# Altium schematic sheet 0164_V1P05_CPU GENERATI.SchDoc
size 848 x 558 mm
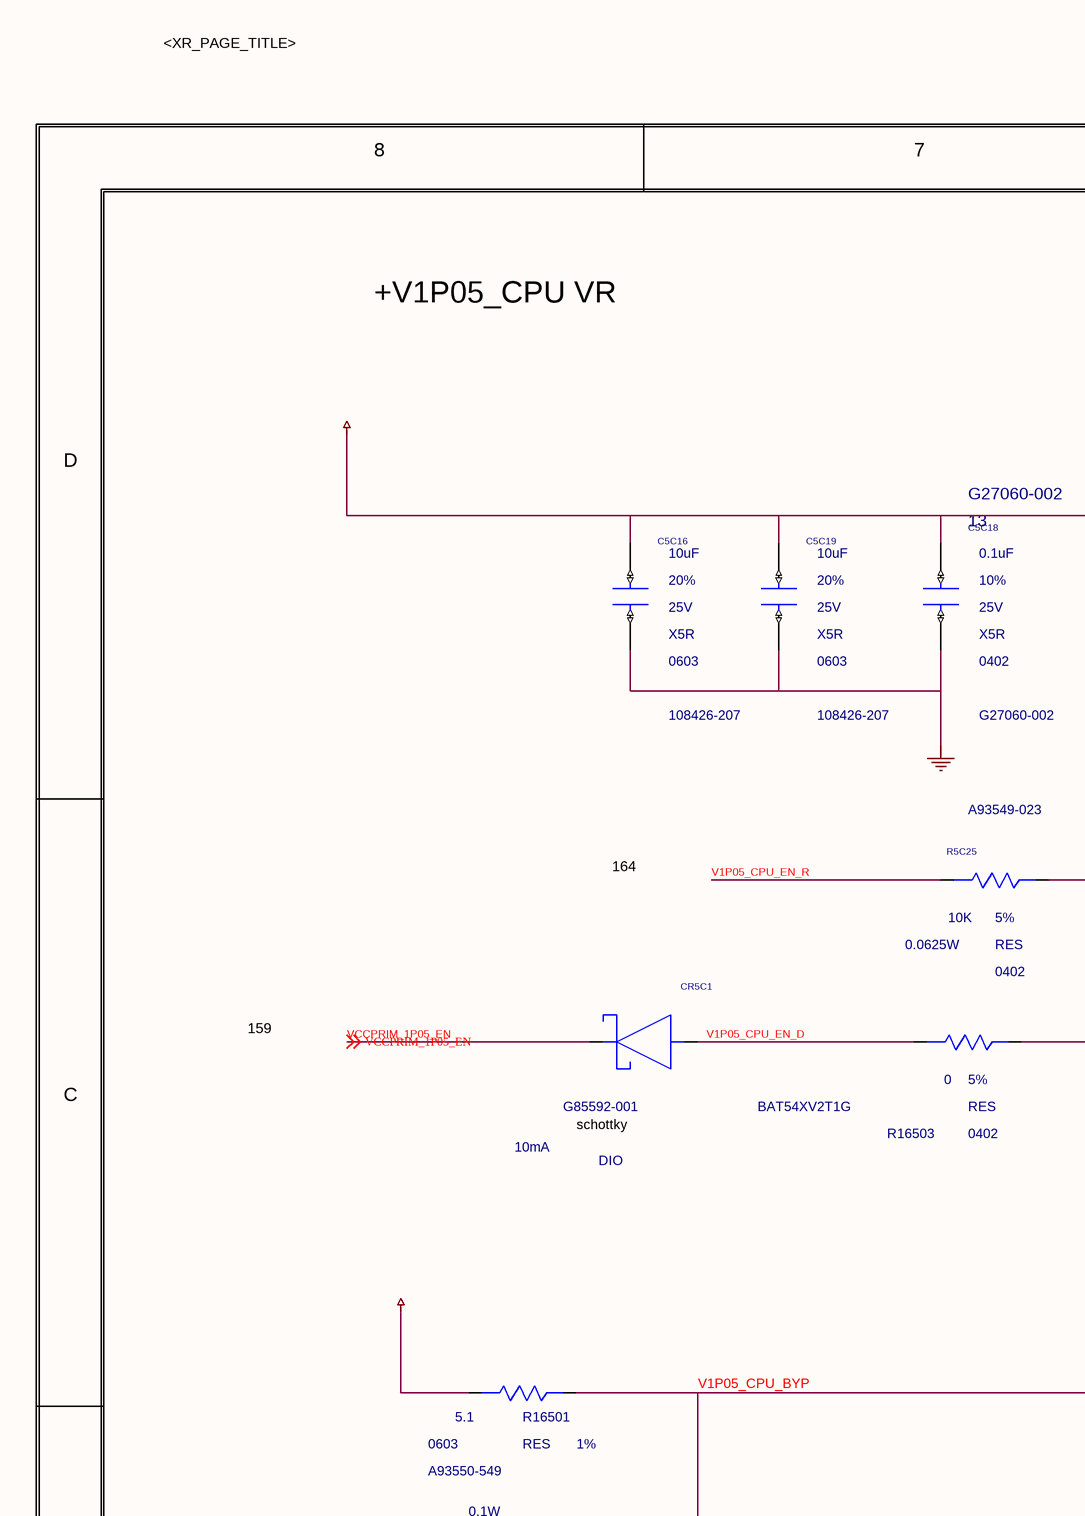
[diagram p0: 0164_V1P05_CPU GENERATI.SchDoc, top left]
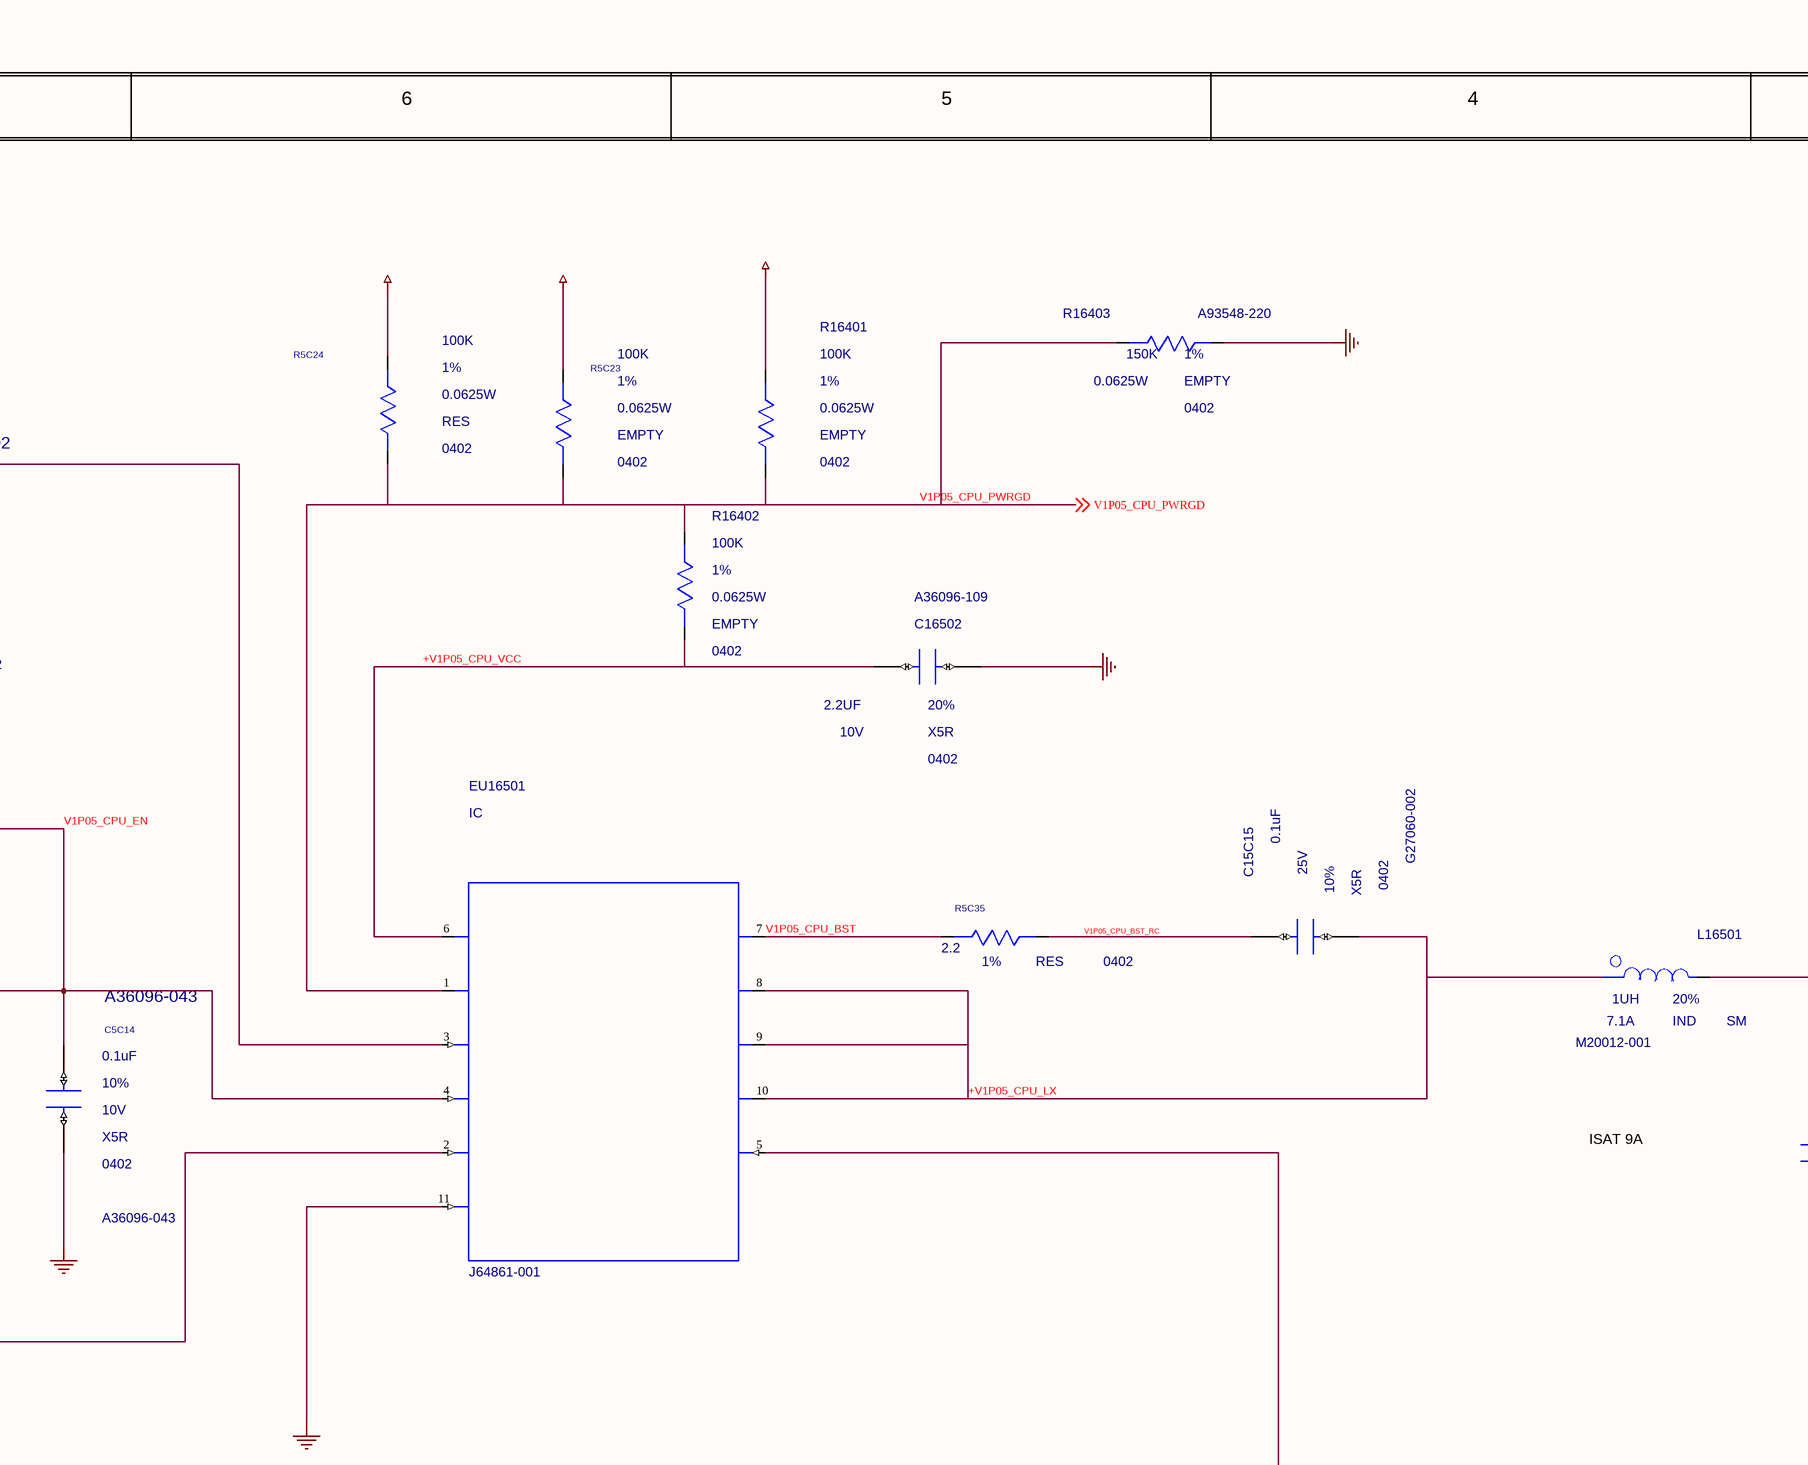
[diagram p1: 0164_V1P05_CPU GENERATI.SchDoc, top middle]
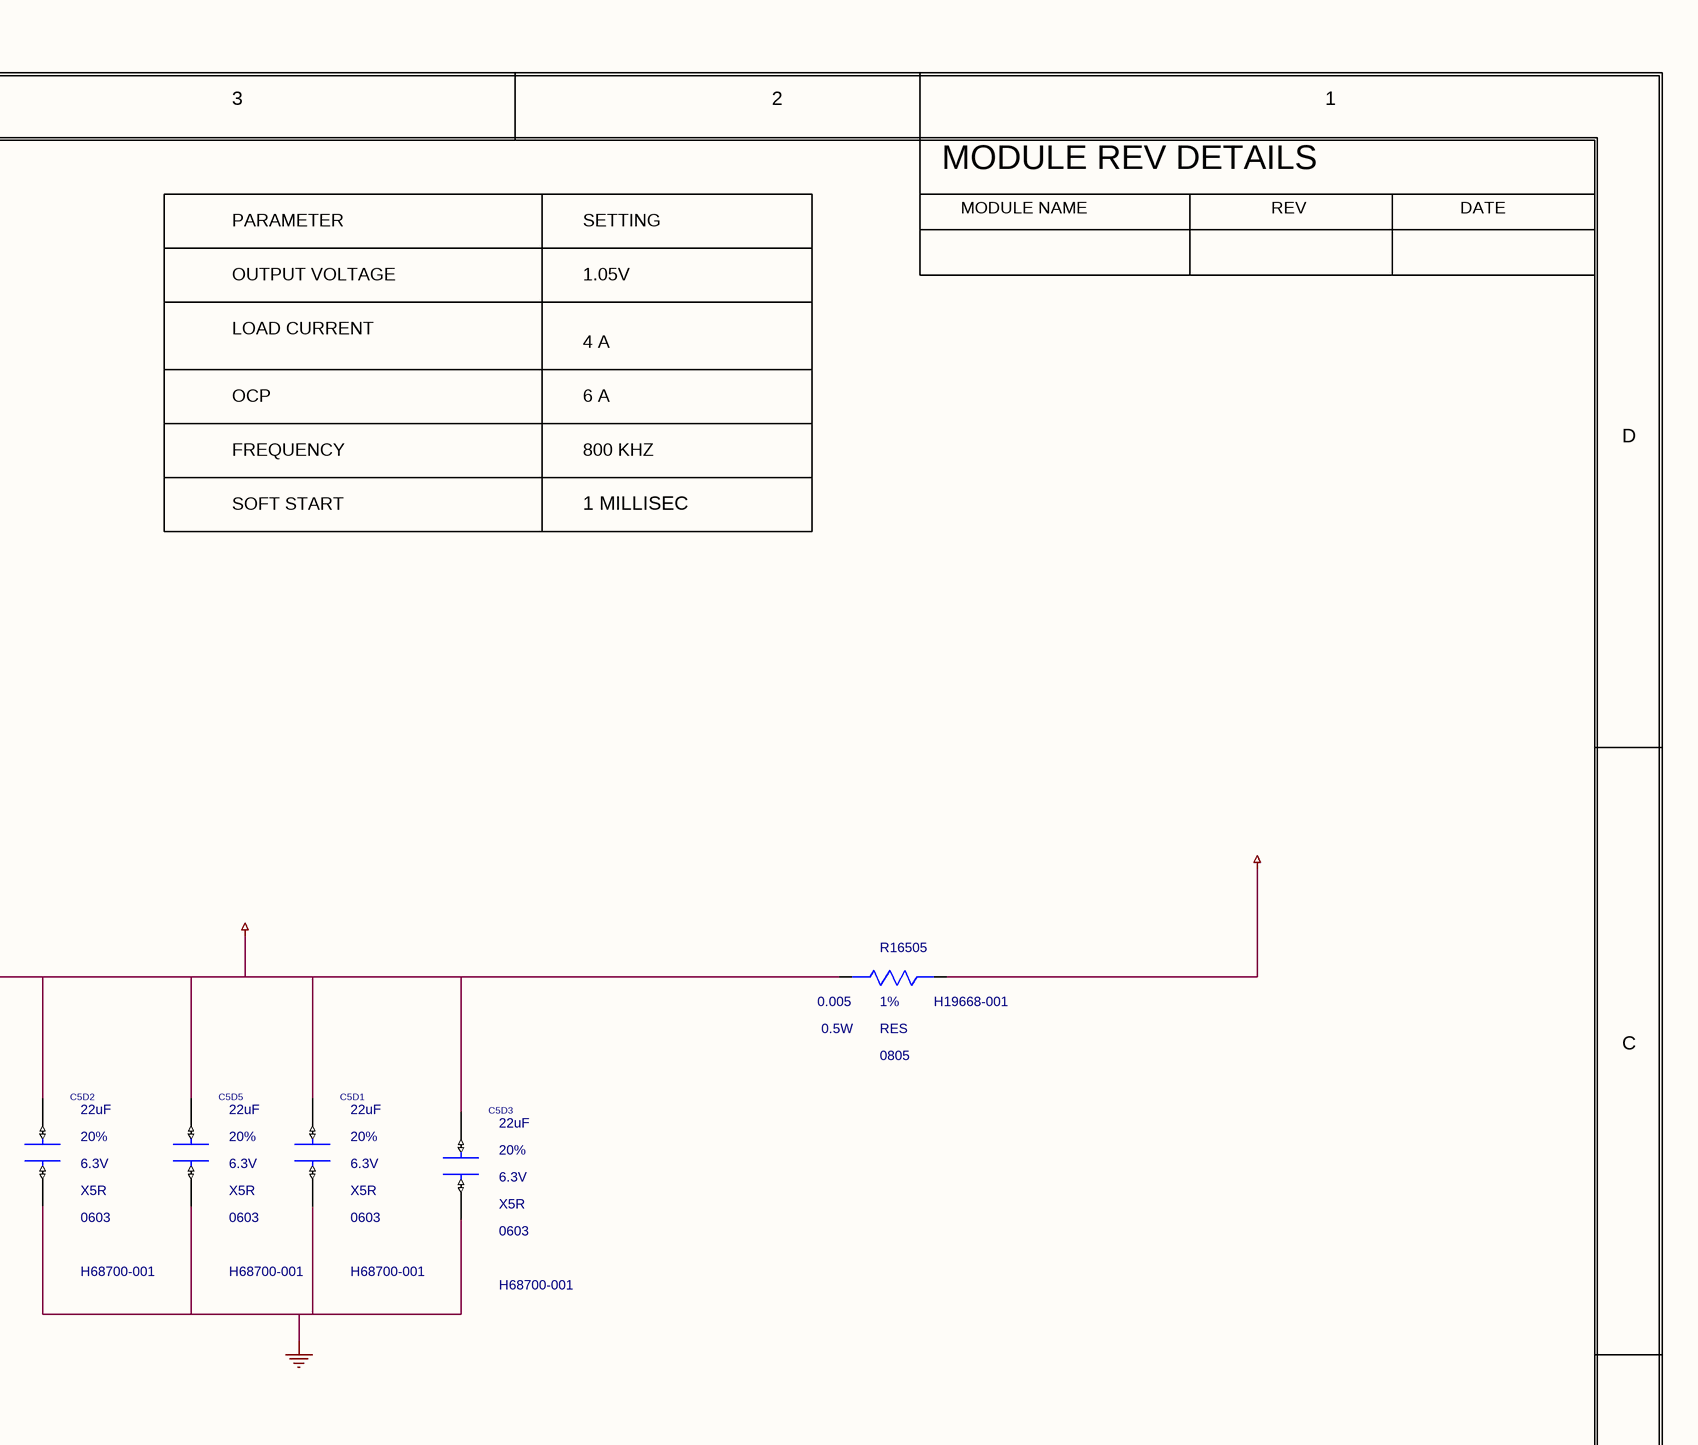
[diagram p2: 0164_V1P05_CPU GENERATI.SchDoc, top right]
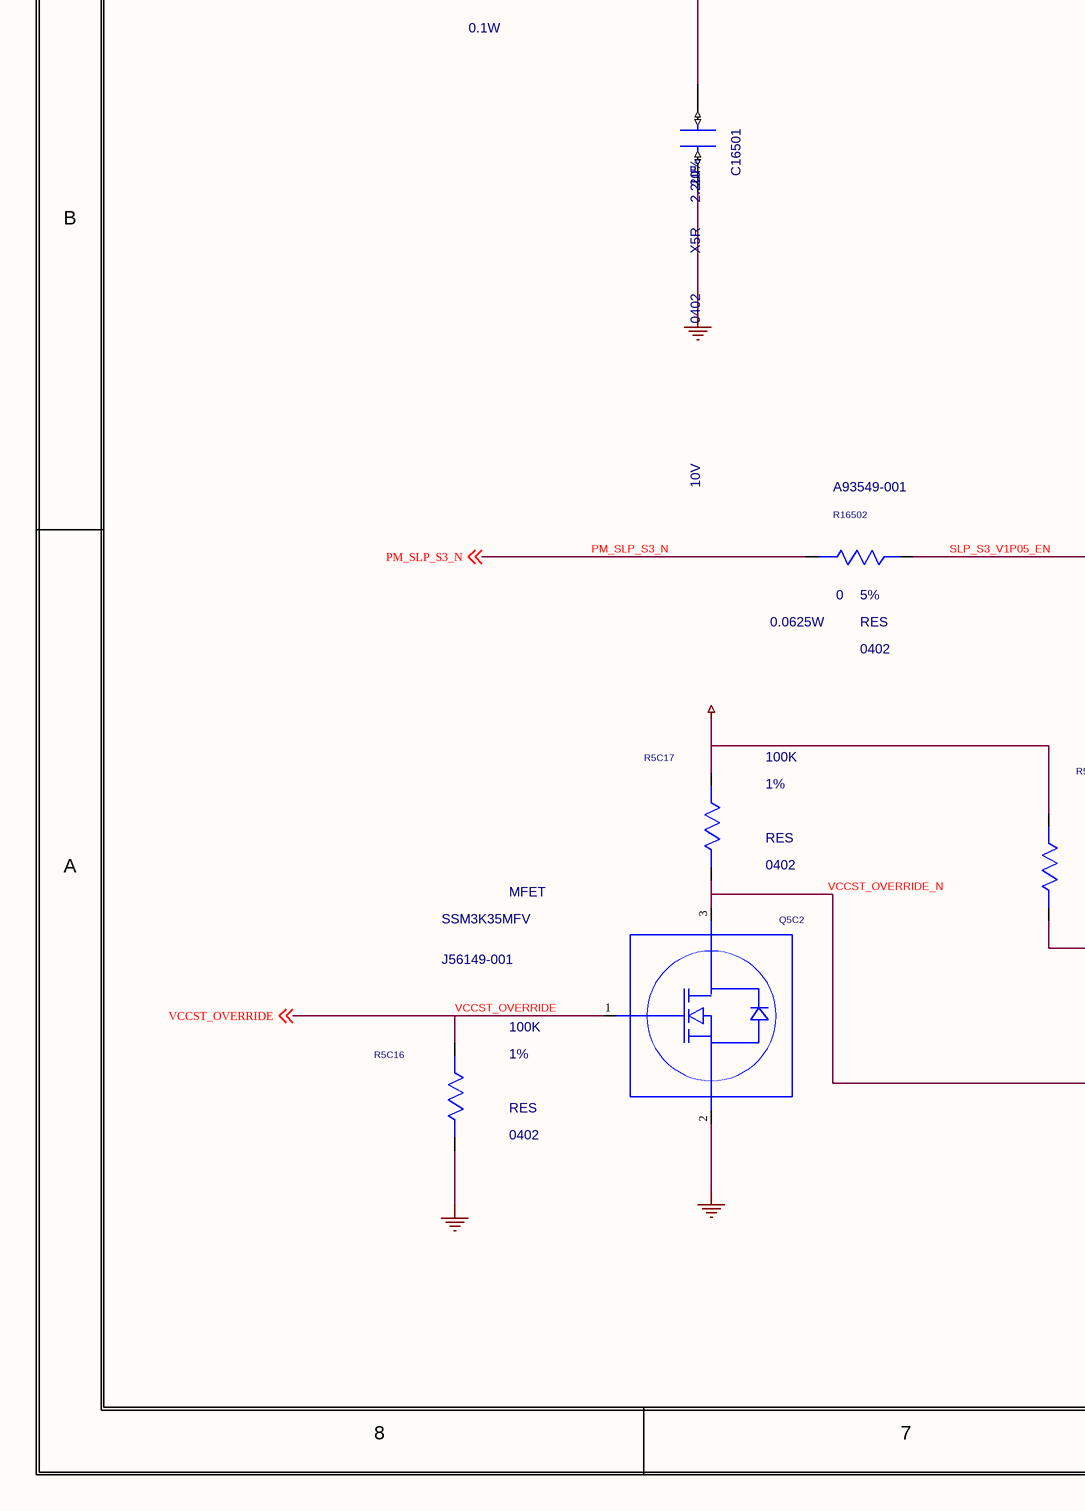
[diagram p3: 0164_V1P05_CPU GENERATI.SchDoc, bottom left]
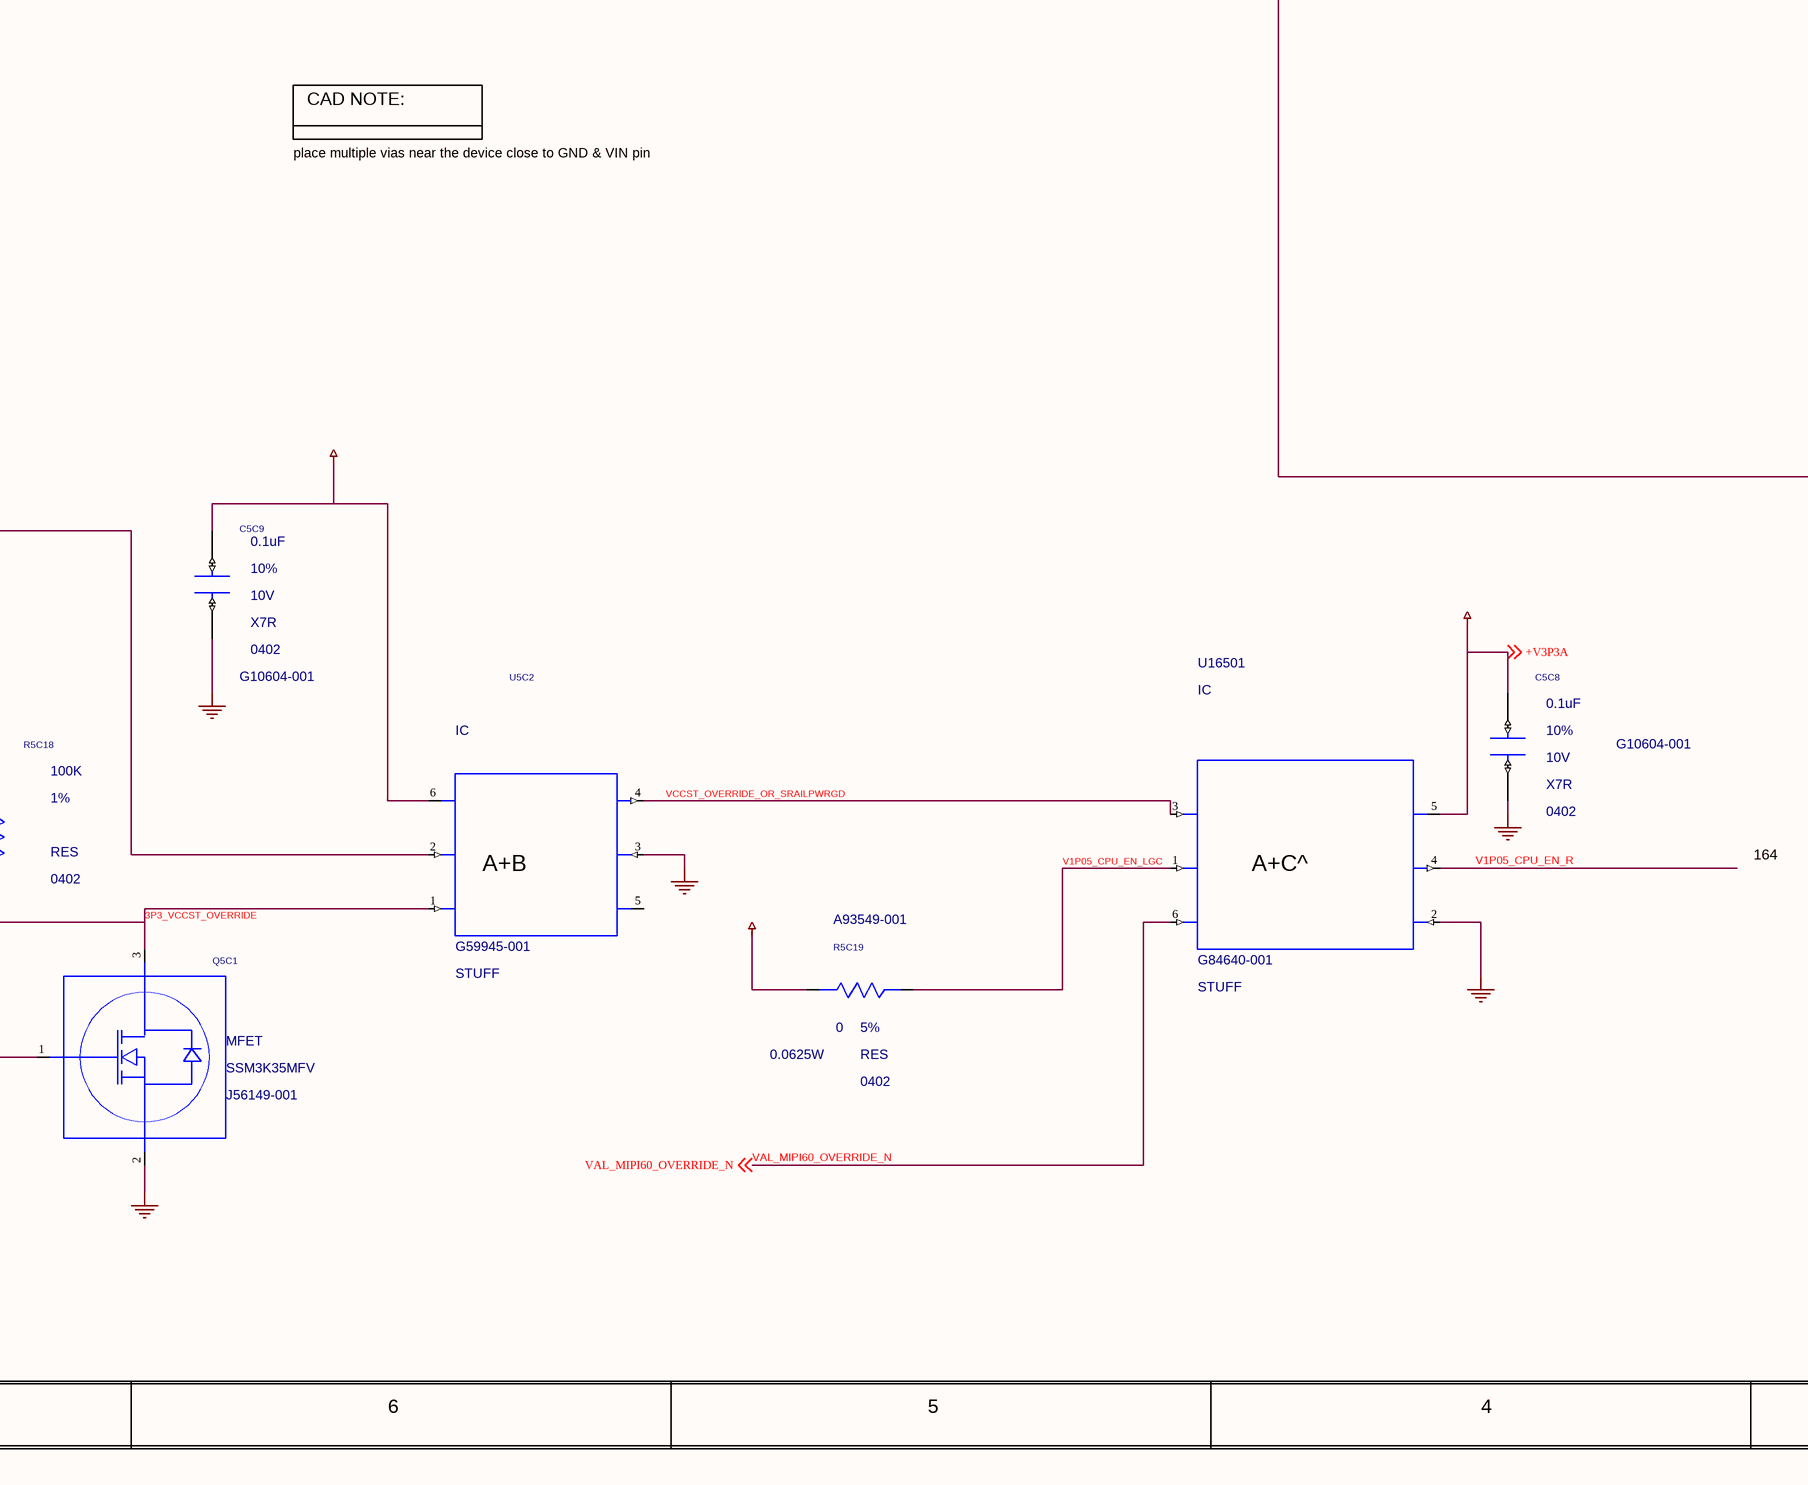
[diagram p4: 0164_V1P05_CPU GENERATI.SchDoc, bottom middle]
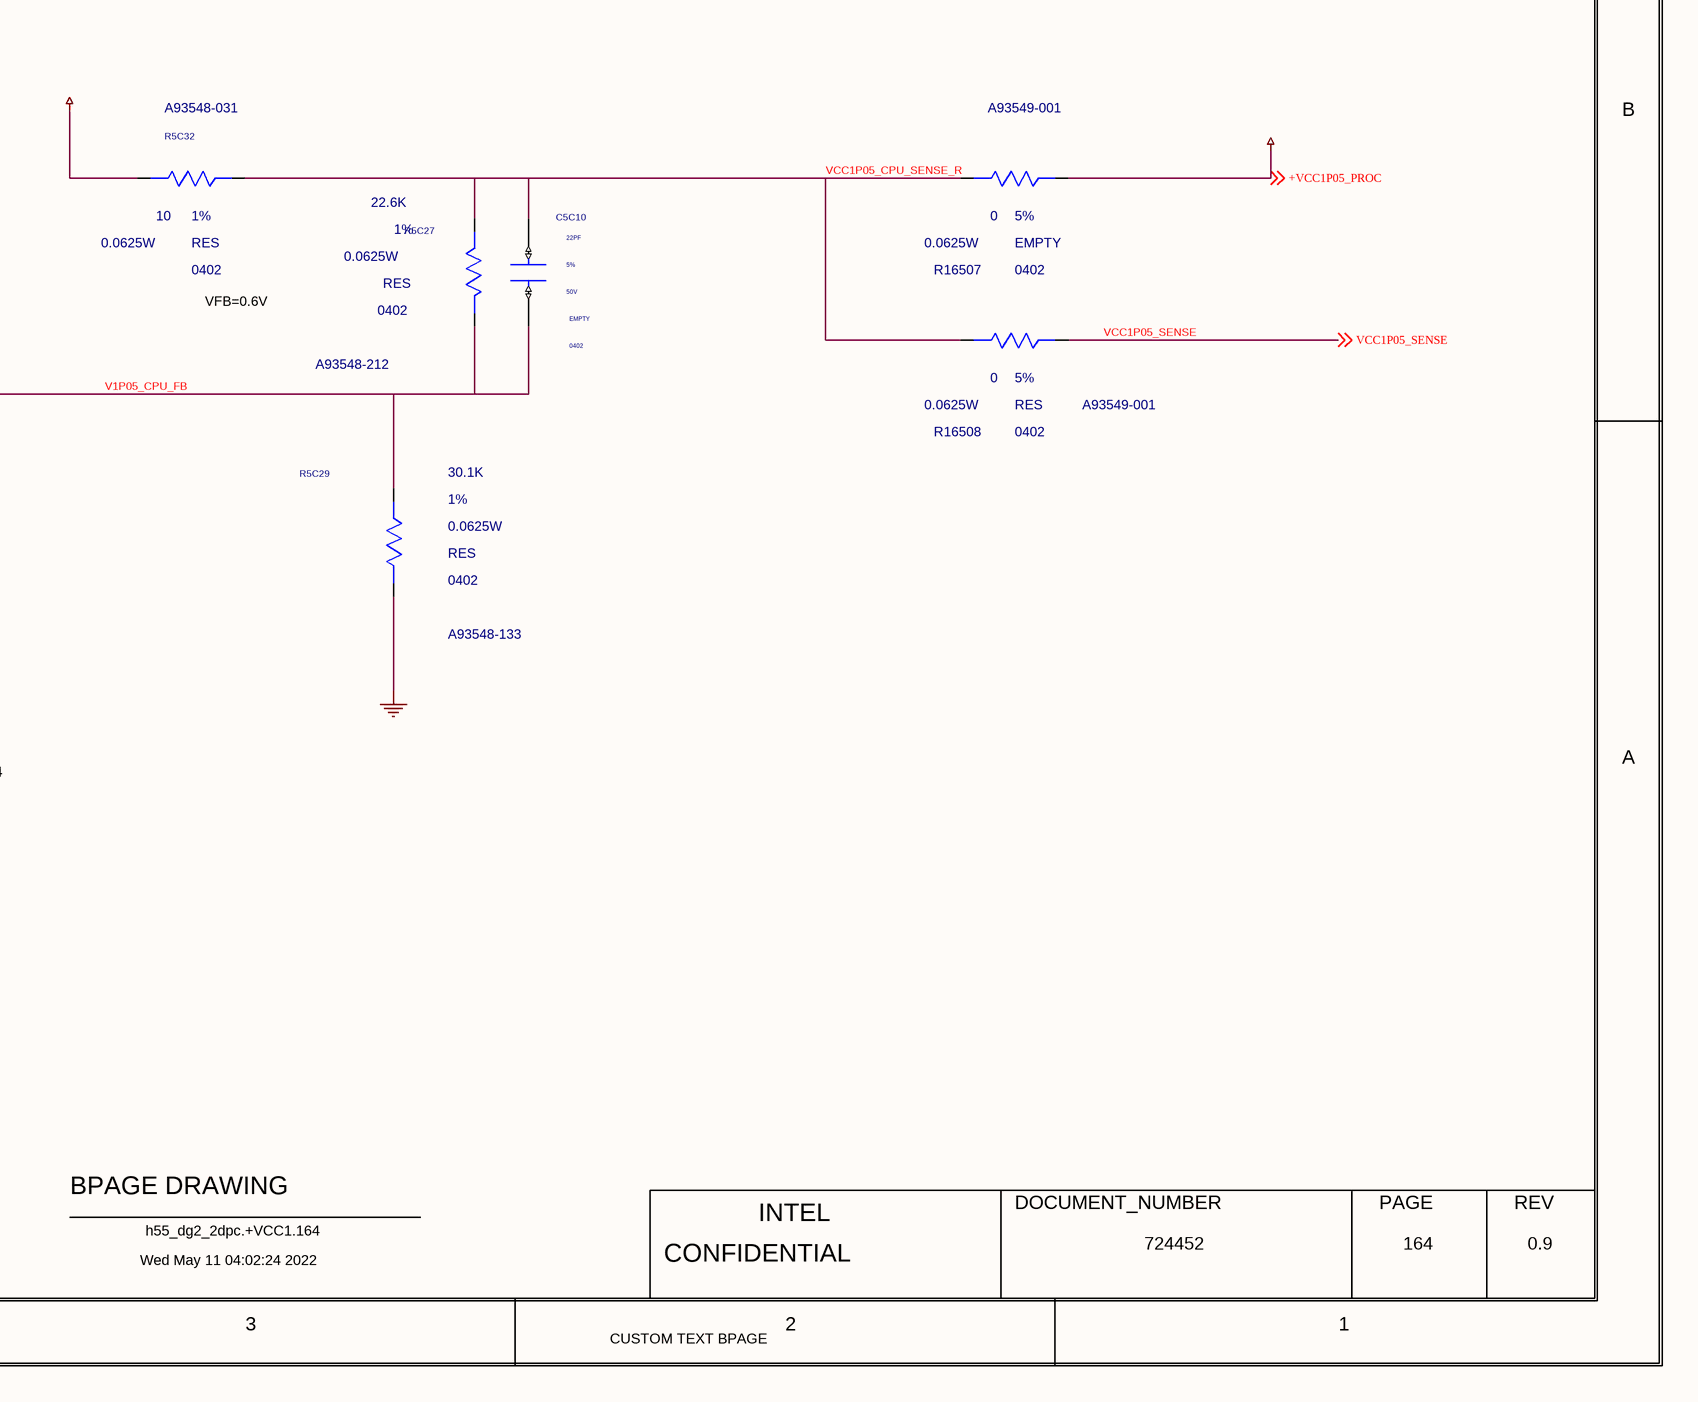
[diagram p5: 0164_V1P05_CPU GENERATI.SchDoc, bottom right]

## Parts
C5C8  0.1uF  MATERIAL: X7R  PACK_TYPE: 0402  PART_NUMBER: G10604-001  TOLERANCE: 10%  VOLTAGE: 10V  [CTK0_SM0402_1050X550_MA]
C5C9  0.1uF  MATERIAL: X7R  PACK_TYPE: 0402  PART_NUMBER: G10604-001  TOLERANCE: 10%  VOLTAGE: 10V  [CTK0_SM0402_1050X550_MA]
C5C10  22PF  MATERIAL: EMPTY  PACK_TYPE: 0402  TOLERANCE: 5%  VOLTAGE: 50V  [CTK2_SM0402_1050X550_MA]
C5C14  0.1uF  MATERIAL: X5R  PACK_TYPE: 0402  PART_NUMBER: A36096-043  TOLERANCE: 10%  VOLTAGE: 10V  [CTK0_SM0402_1050X550_MA]
C5C16  10uF  MATERIAL: X5R  PACK_TYPE: 0603  PART_NUMBER: 108426-207  TOLERANCE: 20%  VOLTAGE: 25V  [CTK0_SM0603_1800X1000_MA]
C5C18  0.1uF  MATERIAL: X5R  PACK_TYPE: 0402  PART_NUMBER: G27060-002  TOLERANCE: 10%  VOLTAGE: 25V  REUSE_ID: 13  [CTK2_SM0402_1050X550_MA]
C5C19  10uF  MATERIAL: X5R  PACK_TYPE: 0603  PART_NUMBER: 108426-207  TOLERANCE: 20%  VOLTAGE: 25V  [CTK0_SM0603_1800X1000_MA]
C5D1  22uF  MATERIAL: X5R  PACK_TYPE: 0603  PART_NUMBER: H68700-001  TOLERANCE: 20%  VOLTAGE: 6.3V  [CTK0_SM0603_1800X1000_MA]
C5D2  22uF  MATERIAL: X5R  PACK_TYPE: 0603  PART_NUMBER: H68700-001  TOLERANCE: 20%  VOLTAGE: 6.3V  [CTK0_SM0603_1800X1000_MA]
C5D3  22uF  MATERIAL: X5R  PACK_TYPE: 0603  PART_NUMBER: H68700-001  TOLERANCE: 20%  VOLTAGE: 6.3V  [CTK0_SM0603_1800X1000_MA]
C5D5  22uF  MATERIAL: X5R  PACK_TYPE: 0603  PART_NUMBER: H68700-001  TOLERANCE: 20%  VOLTAGE: 6.3V  [CTK0_SM0603_1800X1000_MA]
C15C15  0.1uF  MATERIAL: X5R  PACK_TYPE: 0402  PART_NUMBER: G27060-002  TOLERANCE: 10%  VOLTAGE: 25V  [CTK2_SM0402_1050X550_MA]
C16501  2.2UF  MATERIAL: X5R  PACK_TYPE: 0402  TOLERANCE: 20%  VOLTAGE: 10V  [CTK2_SM0402_1070X570_MA]
C16502  2.2UF  MATERIAL: X5R  PACK_TYPE: 0402  PART_NUMBER: A36096-109  TOLERANCE: 20%  VOLTAGE: 10V  [CTK0_SM0402_1070X570_MA]
CR5C1  BAT54XV2T1G  CURRENT: 10mA  MATERIAL: DIO  PART_NUMBER: G85592-001  [CTK2_SCR_1300X900_MA]
EU16501  MATERIAL: IC  PART_NUMBER: J64861-001  [CTK2_LCC10_S3050_DF1625X2475_500_MA]  (hidden comment: C_RT6219)
L16501  1UH  CURRENT: 7.1A  MATERIAL: IND  PACK_TYPE: SM  PART_NUMBER: M20012-001  TOLERANCE: 20%  [CTK0_SMI3225M_3350X2650_MA_VR]
Q5C1  SSM3K35MFV  MATERIAL: MFET  PART_NUMBER: J56149-001  [CTK2_SOT723_850X1250_400_MA]
Q5C2  SSM3K35MFV  MATERIAL: MFET  PART_NUMBER: J56149-001  [CTK2_SOT723_850X1250_400_MA]
R5C16  100K  MATERIAL: RES  PACK_TYPE: 0402  TOLERANCE: 1%  [CTK0_SM0402_1100X550_MA]
R5C17  100K  MATERIAL: RES  PACK_TYPE: 0402  TOLERANCE: 1%  [CTK0_SM0402_1100X550_MA]
R5C18  100K  MATERIAL: RES  PACK_TYPE: 0402  TOLERANCE: 1%  [CTK0_SM0402_1100X550_MA]
R5C19  0  MATERIAL: RES  PACK_TYPE: 0402  PART_NUMBER: A93549-001  TOLERANCE: 5%  WATTAGE: 0.0625W  [CTK0_SM0402_1100X550_MA]
R5C23  100K  MATERIAL: EMPTY  PACK_TYPE: 0402  TOLERANCE: 1%  WATTAGE: 0.0625W  [CTK0_SM0402_1100X550_MA]
R5C24  100K  MATERIAL: RES  PACK_TYPE: 0402  TOLERANCE: 1%  WATTAGE: 0.0625W  [CTK0_SM0402_1100X550_MA]
R5C25  10K  MATERIAL: RES  PACK_TYPE: 0402  PART_NUMBER: A93549-023  TOLERANCE: 5%  WATTAGE: 0.0625W  [CTK0_SM0402_1100X550_MA]
R5C27  22.6K  MATERIAL: RES  PACK_TYPE: 0402  PART_NUMBER: A93548-212  TOLERANCE: 1%  WATTAGE: 0.0625W  [CTK0_SM0402_1100X550_MA]
R5C29  30.1K  MATERIAL: RES  PACK_TYPE: 0402  PART_NUMBER: A93548-133  TOLERANCE: 1%  WATTAGE: 0.0625W  [CTK0_SM0402_1100X550_MA]
R5C32  10  MATERIAL: RES  PACK_TYPE: 0402  PART_NUMBER: A93548-031  TOLERANCE: 1%  WATTAGE: 0.0625W  [CTK0_SM0402_1100X550_MA]
R5C35  2.2  MATERIAL: RES  PACK_TYPE: 0402  TOLERANCE: 1%  [CTK0_SM0402_1100X550_MA]
R16401  100K  MATERIAL: EMPTY  PACK_TYPE: 0402  TOLERANCE: 1%  WATTAGE: 0.0625W  [CTK0_SM0402_1100X550_MA]
R16402  100K  MATERIAL: EMPTY  PACK_TYPE: 0402  TOLERANCE: 1%  WATTAGE: 0.0625W  [CTK0_SM0402_1100X550_MA]
R16403  150K  MATERIAL: EMPTY  PACK_TYPE: 0402  PART_NUMBER: A93548-220  TOLERANCE: 1%  WATTAGE: 0.0625W  [CTK2_SM0402_1100X550_MA]
R16501  5.1  MATERIAL: RES  PACK_TYPE: 0603  PART_NUMBER: A93550-549  TOLERANCE: 1%  WATTAGE: 0.1W  [CTK2_SM0603_1800X900_MA]
R16502  0  MATERIAL: RES  PACK_TYPE: 0402  PART_NUMBER: A93549-001  TOLERANCE: 5%  WATTAGE: 0.0625W  [CTK0_SM0402_1100X550_MA]
R16503  0  MATERIAL: RES  PACK_TYPE: 0402  TOLERANCE: 5%  [CTK0_SM0402_1100X550_MA]
R16505  0.005  MATERIAL: RES  PACK_TYPE: 0805  PART_NUMBER: H19668-001  TOLERANCE: 1%  WATTAGE: 0.5W  [CTK2_SM0805_2150X1350_MA]
R16507  0  MATERIAL: EMPTY  PACK_TYPE: 0402  PART_NUMBER: A93549-001  TOLERANCE: 5%  WATTAGE: 0.0625W  [CTK0_SM0402_1100X550_MA]
R16508  0  MATERIAL: RES  PACK_TYPE: 0402  PART_NUMBER: A93549-001  TOLERANCE: 5%  WATTAGE: 0.0625W  [CTK0_SM0402_1100X550_MA]
U5C2  BOM_USE: STUFF  MATERIAL: IC  PART_NUMBER: G59945-001  [TK2_LCC6_S1050_350_MA]  (hidden comment: TTL1G32GF_2)
U16501  BOM_USE: STUFF  MATERIAL: IC  PART_NUMBER: G84640-001  [TK2_LCC6_S1050_350_MB]  (hidden comment: SN74AUP1G97_2)

## Nets
+V1P05_OUT: C5D1.1(A) C5D2.1(A) C5D3.1(A) C5D5.1(A) L16501.2(B) R5C32.1(A) R16505.1(A)
+V3P3A: C5C8.1(A) C5C9.1(A) R5C17.1(A) R5C18.1(A) R5C19.1(A) R5C23.1(A) U5C2.6(VCC) U16501.5(VCC) ; off-sheet +V3P3A
+V3P3S: R5C24.1(A)
+V5A_L: R16501.2(B)
+VBATA: C5C16.1(A) C5C18.1(A) C5C19.1(A) EU16501.3(VIN)
+VCC1P05_PROC: R16401.1(A) R16505.2(B) R16507.2(B) ; off-sheet +VCC1P05_PROC
GND: C5C8.2(B) C5C9.2(B) C5C14.2(B) C5C16.2(B) C5C18.2(B) C5C19.2(B) C5D1.2(B) C5D2.2(B) C5D3.2(B) C5D5.2(B) C16501.2(B) C16502.2(B) EU16501.11(PGND_TPD) Q5C1.2(S) Q5C2.2(S) R5C16.2(B) R5C29.2(B) R16403.2(B) U5C2.3(GND) U16501.2(GND)
3P3_VCCST_OVERRIDE: Q5C1.3(D) R5C18.2(B) U5C2.1(B)
+V1P05_CPU_LX: C15C15.2(B) EU16501.8(SW_1) EU16501.9(SW_2) EU16501.10(SW_3) L16501.1(A)
+V1P05_CPU_VCC: C16502.1(A) EU16501.6(VCC) R16402.2(B)
PM_SLP_S3_N: R16502.1(A) ; off-sheet PM_SLP_S3_N
SLP_S3_V1P05_EN: R16502.2(B) U5C2.2(A)
V1P05_CPU_BST: EU16501.7(BOOT) R5C35.1(A)
V1P05_CPU_BST_RC: C15C15.1(A) R5C35.2(B)
V1P05_CPU_BYP: C16501.1(A) EU16501.2(VBYP) R16501.1(A)
V1P05_CPU_EN: C5C14.1(A) EU16501.4(EN) R5C25.2(B) R16503.2(B)
V1P05_CPU_EN_D: CR5C1.A(ANODE) R16503.1(A)
V1P05_CPU_EN_LGC: R5C19.2(B) U16501.1(B)
V1P05_CPU_EN_R: R5C25.1(A) U16501.4(Y)
V1P05_CPU_FB: C5C10.2(B) EU16501.5(FB) R5C27.2(B) R5C29.1(A)
V1P05_CPU_PWRGD: EU16501.1(PGOOD) R5C23.2(B) R5C24.2(B) R16401.2(B) R16402.1(A) R16403.1(A) ; off-sheet V1P05_CPU_PWRGD
VAL_MIPI60_OVERRIDE_N: U16501.6(C) ; off-sheet VAL_MIPI60_OVERRIDE_N
VCC1P05_CPU_SENSE_R: C5C10.1(A) R5C27.1(A) R5C32.2(B) R16507.1(A) R16508.1(A)
VCC1P05_SENSE: R16508.2(B) ; off-sheet VCC1P05_SENSE
VCCPRIM_1P05_EN: CR5C1.C(CATHODE) ; off-sheet VCCPRIM_1P05_EN
VCCST_OVERRIDE: Q5C2.1(G) R5C16.1(A) ; off-sheet VCCST_OVERRIDE
VCCST_OVERRIDE_N: Q5C1.1(G) Q5C2.3(D) R5C17.2(B)
VCCST_OVERRIDE_OR_SRAILPWRGD: U5C2.4(Y) U16501.3(A)

Not connected (* = marked no-connect by the designer): U5C2 5(NC)

## Notes on the sheet
- <XR_PAGE_TITLE>
- 8
- 7
- 6
- 5
- 4
- 3
- 2
- 1
- MODULE REV DETAILS
- +V1P05_CPU VR
- PARAMETER
- SETTING
- MODULE NAME
- REV
- DATE
- OUTPUT VOLTAGE
- LOAD CURRENT
- 1.05V
- OCP
- 6 A
- 4 A
- D
- FREQUENCY
- 800 KHZ
- SOFT START
- 1 MILLISEC
- 164
- 159
- C
- schottky
- ISAT 9A
- place multiple vias near the device close to GND & VIN pin
- CAD NOTE:
- B
- VFB=0.6V
- A
- (near U5C2) A+B
- (near U16501) A+C^
- BPAGE DRAWING
- INTEL
- DOCUMENT_NUMBER
- PAGE
- Wed May 11 04:02:24 2022
- h55_dg2_2dpc.+VCC1.164
- CONFIDENTIAL
- 724452
- 0.9
- CUSTOM TEXT BPAGE

## Library data of the parts
C5C8 = C_CAP: CDS_PHYS_PART_NAME: CAP_402-.1UF,10%,25V,402"; CDS_PART_NAME: C_CAP_0402-G10604-001,X7R,0.1UF,10V,10%,TK0,GENERIC; CDS_LMAN_SYM_OUTLINE: -50,50,50,-50; FP_TECH: TK0; IP: GENERIC; ROOM: NONE; OriginalSymbolOrigin: (-50,25); XY: (2500,0); VER: 1; ROT: 0; PHYS_PAGE: 164; LOCATION: C5C8; DRAWING: @RVP1_ADL_SB_ADP_S_DDR5_SODIMM_2DPC_LIB.H55_DG2_2DPC(SCH_1):PAGE533; CDS_LIB: c_discrete; VARIANT: ?; PCB Footprint: CTK0_SM0402_1050X550_MA; SEC_TYPE: 0402; CHIPS_PART_NAME: C_CAP; CDS_LOCATION: C5C8; ASI_MODEL: G10604-001
C5C9 = C_CAP: CDS_PHYS_PART_NAME: CAP_402-.1UF,10%,25V,402"; CDS_PART_NAME: C_CAP_0402-G10604-001,X7R,0.1UF,10V,10%,TK0,GENERIC; CDS_LMAN_SYM_OUTLINE: -50,50,50,-50; FP_TECH: TK0; IP: GENERIC; ROOM: NONE; OriginalSymbolOrigin: (-50,25); XY: (100,300); VER: 1; ROT: 0; PHYS_PAGE: 164; LOCATION: C5C9; DRAWING: @RVP1_ADL_SB_ADP_S_DDR5_SODIMM_2DPC_LIB.H55_DG2_2DPC(SCH_1):PAGE533; CDS_LIB: c_discrete; VARIANT: ?; PCB Footprint: CTK0_SM0402_1050X550_MA; SEC_TYPE: 0402; CHIPS_PART_NAME: C_CAP; CDS_LOCATION: C5C9; ASI_MODEL: G10604-001
C5C10 = C_CAP: PART_NUMBER: A36095-030; CDS_PHYS_PART_NAME: CAP_402-22PF,5%,50V,402"; CDS_PART_NAME: C_CAP_0402-A36095-030,EMPTY,22PF,50V,5%,TK2,GENERIC; CDS_LMAN_SYM_OUTLINE: -50,50,50,-50; FP_TECH: TK2; IP: GENERIC; ROOM: NONE; OriginalSymbolOrigin: (-50,25); XY: (3975,725); VER: 1; ROT: 0; PHYS_PAGE: 164; LOCATION: C5C10; DRAWING: @RVP1_ADL_SB_ADP_S_DDR5_SODIMM_2DPC_LIB.H55_DG2_2DPC(SCH_1):PAGE533; CDS_LIB: c_discrete; VARIANT: ?; PCB Footprint: CTK2_SM0402_1050X550_MA; CHIPS_PART_NAME: C_CAP; CDS_LOCATION: C5C10; ASI_MODEL: A36095-030
C5C14 = C_CAP: CDS_PHYS_PART_NAME: C_CAP_0402-A36096-043,X5R,0.1UF,10V,10%,TK0,GENERIC; CDS_LMAN_SYM_OUTLINE: -50,50,50,-50; FP_TECH: TK0; IP: GENERIC; ROOM: NONE; OriginalSymbolOrigin: (-50,25); XY: (-175,2050); VER: 1; ROT: 0; PHYS_PAGE: 164; LOCATION: C5C14; DRAWING: @RVP1_ADL_SB_ADP_S_DDR5_SODIMM_2DPC_LIB.H55_DG2_2DPC(SCH_1):PAGE533; CDS_LIB: c_discrete; VARIANT: ?; PCB Footprint: CTK0_SM0402_1050X550_MA; SEC_TYPE: 0402; CHIPS_PART_NAME: C_CAP; CDS_PART_NAME: C_CAP_0402-A36096-043,X5R,0.1UF,10V,10%,TK0,GENERIC; CDS_LOCATION: C5C14; ASI_MODEL: A36096-043
C5C16 = C_CAP: CDS_PHYS_PART_NAME: C_CAP_0603-108426-207,X5R,10UF,25V,20%,TK0,GENERIC; CDS_LMAN_SYM_OUTLINE: -50,50,50,-50; FP_TECH: TK0; IP: GENERIC; ROOM: NONE; OriginalSymbolOrigin: (-50,25); XY: (-1075,3075); VER: 1; ROT: 0; PHYS_PAGE: 164; LOCATION: C5C16; DRAWING: @RVP1_ADL_SB_ADP_S_DDR5_SODIMM_2DPC_LIB.H55_DG2_2DPC(SCH_1):PAGE533; CDS_LIB: c_discrete; VARIANT: ?; PCB Footprint: CTK0_SM0603_1800X1000_MA; SEC_TYPE: 0603; CHIPS_PART_NAME: C_CAP; CDS_PART_NAME: C_CAP_0603-108426-207,X5R,10UF,25V,20%,TK0,GENERIC; CDS_LOCATION: C5C16; ASI_MODEL: 108426-207
C5C18 = C_CAP: CDS_PHYS_PART_NAME: C_CAP_0402-G27060-002,X5R,0.1UF,25V,10%,TK2,GENERIC; CDS_LMAN_SYM_OUTLINE: -50,50,50,-50; FP_TECH: TK2; IP: GENERIC; ROOM: NONE; OriginalSymbolOrigin: (-50,25); XY: (-500,3075); VER: 1; ROT: 0; PHYS_PAGE: 164; LOCATION: C5C18; DRAWING: @RVP1_ADL_SB_ADP_S_DDR5_SODIMM_2DPC_LIB.H55_DG2_2DPC(SCH_1):PAGE533; CDS_LIB: c_discrete; VARIANT: ?; PCB Footprint: CTK2_SM0402_1050X550_MA; CHIPS_PART_NAME: C_CAP; CDS_PART_NAME: C_CAP_0402-G27060-002,X5R,0.1UF,25V,10%,TK2,GENERIC; CDS_LOCATION: C5C18; ASI_MODEL: G27060-002
C5C19 = C_CAP: CDS_PHYS_PART_NAME: CAP_603-10UF,20%,16V,603"; CDS_PART_NAME: C_CAP_0603-108426-207,X5R,10UF,25V,20%,TK0,GENERIC; CDS_LMAN_SYM_OUTLINE: -50,50,50,-50; FP_TECH: TK0; IP: GENERIC; ROOM: NONE; OriginalSymbolOrigin: (-50,25); XY: (-800,3075); VER: 1; ROT: 0; PHYS_PAGE: 164; LOCATION: C5C19; DRAWING: @RVP1_ADL_SB_ADP_S_DDR5_SODIMM_2DPC_LIB.H55_DG2_2DPC(SCH_1):PAGE533; CDS_LIB: c_discrete; VARIANT: ?; PCB Footprint: CTK0_SM0603_1800X1000_MA; SEC_TYPE: 0603; CHIPS_PART_NAME: C_CAP; CDS_LOCATION: C5C19; ASI_MODEL: 108426-207
C5D1 = C_CAP: CDS_PHYS_PART_NAME: CAP_805-22UF,20%,6.3V,805"; CDS_PART_NAME: C_CAP_0603-H68700-001,X5R,22UF,6.3V,20%,TK0,GENERIC; CDS_LMAN_SYM_OUTLINE: -50,50,50,-50; FP_TECH: TK0; IP: GENERIC; ROOM: NONE; OriginalSymbolOrigin: (-50,25); XY: (3575,1950); VER: 1; ROT: 0; PHYS_PAGE: 164; LOCATION: C5D1; DRAWING: @RVP1_ADL_SB_ADP_S_DDR5_SODIMM_2DPC_LIB.H55_DG2_2DPC(SCH_1):PAGE533; CDS_LIB: c_discrete; VARIANT: ?; PCB Footprint: CTK0_SM0603_1800X1000_MA; SEC_TYPE: 0603; CHIPS_PART_NAME: C_CAP; CDS_LOCATION: C5D1; ASI_MODEL: H68700-001
C5D2 = C_CAP: CDS_PHYS_PART_NAME: C_CAP_0603-H68700-001,X5R,22UF,6.3V,20%,TK0,GENERIC; CDS_LMAN_SYM_OUTLINE: -50,50,50,-50; FP_TECH: TK0; IP: GENERIC; ROOM: NONE; OriginalSymbolOrigin: (-50,25); XY: (3075,1950); VER: 1; ROT: 0; PHYS_PAGE: 164; LOCATION: C5D2; DRAWING: @RVP1_ADL_SB_ADP_S_DDR5_SODIMM_2DPC_LIB.H55_DG2_2DPC(SCH_1):PAGE533; CDS_LIB: c_discrete; VARIANT: ?; PCB Footprint: CTK0_SM0603_1800X1000_MA; SEC_TYPE: 0603; CHIPS_PART_NAME: C_CAP; CDS_PART_NAME: C_CAP_0603-H68700-001,X5R,22UF,6.3V,20%,TK0,GENERIC; CDS_LOCATION: C5D2; ASI_MODEL: H68700-001
C5D3 = C_CAP: CDS_PHYS_PART_NAME: CAP_1206-100UF,20%,6.3V,1206,E"; CDS_PART_NAME: C_CAP_0603-H68700-001,X5R,22UF,6.3V,20%,TK0,GENERIC; CDS_LMAN_SYM_OUTLINE: -50,50,50,-50; FP_TECH: TK0; IP: GENERIC; ROOM: NONE; OriginalSymbolOrigin: (-50,25); XY: (3850,1925); VER: 1; ROT: 0; PHYS_PAGE: 164; LOCATION: C5D3; DRAWING: @RVP1_ADL_SB_ADP_S_DDR5_SODIMM_2DPC_LIB.H55_DG2_2DPC(SCH_1):PAGE533; CDS_LIB: c_discrete; VARIANT: ?; PCB Footprint: CTK0_SM0603_1800X1000_MA; SEC_TYPE: 0603; CHIPS_PART_NAME: C_CAP; CDS_LOCATION: C5D3; ASI_MODEL: H68700-001
C5D5 = C_CAP: CDS_PHYS_PART_NAME: C_CAP_0603-H68700-001,X5R,22UF,6.3V,20%,TK0,GENERIC; CDS_LMAN_SYM_OUTLINE: -50,50,50,-50; FP_TECH: TK0; IP: GENERIC; ROOM: NONE; OriginalSymbolOrigin: (-50,25); XY: (3350,1950); VER: 1; ROT: 0; PHYS_PAGE: 164; LOCATION: C5D5; DRAWING: @RVP1_ADL_SB_ADP_S_DDR5_SODIMM_2DPC_LIB.H55_DG2_2DPC(SCH_1):PAGE533; CDS_LIB: c_discrete; VARIANT: ?; PCB Footprint: CTK0_SM0603_1800X1000_MA; SEC_TYPE: 0603; CHIPS_PART_NAME: C_CAP; CDS_PART_NAME: C_CAP_0603-H68700-001,X5R,22UF,6.3V,20%,TK0,GENERIC; CDS_LOCATION: C5D5; ASI_MODEL: H68700-001
C15C15 = C_CAP#1: CHIPS_PART_NAME: C_CAP; CDS_PHYS_PART_NAME: C_CAP_0402-G27060-002,X5R,0.1UF,25V,10%,TK2,GENERIC; CDS_LMAN_SYM_OUTLINE: -50,50,50,-50; FP_TECH: TK2; IP: GENERIC; ROOM: NONE; OriginalSymbolOrigin: (-25,50); XY: (2125,2350); VER: 2; ROT: 0; PHYS_PAGE: 164; LOCATION: C15C15; DRAWING: @RVP1_ADL_SB_ADP_S_DDR5_SODIMM_2DPC_LIB.H55_DG2_2DPC(SCH_1):PAGE533; CDS_LIB: c_discrete; VARIANT: ?; PCB Footprint: CTK2_SM0402_1050X550_MA; CDS_PART_NAME: C_CAP_0402-G27060-002,X5R,0.1UF,25V,10%,TK2,GENERIC; CDS_LOCATION: C15C15
C16501 = C_CAP#1: PART_NUMBER: A36096-109; CHIPS_PART_NAME: C_CAP; CDS_PHYS_PART_NAME: C_CAP_0402-A36096-109,X5R,2.2UF,10V,20%,TK2,GENERIC; CDS_LMAN_SYM_OUTLINE: -50,50,50,-50; FP_TECH: TK2; IP: GENERIC; ROOM: NONE; OriginalSymbolOrigin: (-25,50); XY: (-950,1175); VER: 2; ROT: 5; PHYS_PAGE: 164; LOCATION: C16501; DRAWING: @RVP1_ADL_SB_ADP_S_DDR5_SODIMM_2DPC_LIB.H55_DG2_2DPC(SCH_1):PAGE533; CDS_LIB: c_discrete; VARIANT: ?; PCB Footprint: CTK2_SM0402_1070X570_MA; SEC_TYPE: 0402; CDS_PART_NAME: C_CAP_0402-A36096-109,X5R,2.2UF,10V,20%,TK2,GENERIC; CDS_LOCATION: C16501
C16502 = C_CAP#1: CHIPS_PART_NAME: C_CAP; CDS_PHYS_PART_NAME: C_CAP_0402-A36096-109,X5R,2.2UF,10V,20%,TK0,GENERIC; CDS_LMAN_SYM_OUTLINE: -50,50,50,-50; FP_TECH: TK0; IP: GENERIC; ROOM: NONE; OriginalSymbolOrigin: (-25,50); XY: (1425,2850); VER: 2; ROT: 0; PHYS_PAGE: 164; LOCATION: C16502; DRAWING: @RVP1_ADL_SB_ADP_S_DDR5_SODIMM_2DPC_LIB.H55_DG2_2DPC(SCH_1):PAGE533; CDS_LIB: c_discrete; VARIANT: ?; PCB Footprint: CTK0_SM0402_1070X570_MA; SEC_TYPE: 0402; CDS_PART_NAME: C_CAP_0402-A36096-109,X5R,2.2UF,10V,20%,TK0,GENERIC; CDS_LOCATION: C16502
CR5C1 = C_DIODE_SCHOTTKY: CDS_PHYS_PART_NAME: C_DIODE_SCHOTTKY_SM-G85592-001,DIO,BAT54XV2T1G,10MA,TK2,GENERIC; CDS_LMAN_SYM_OUTLINE: -50,100,50,-100; FP_TECH: TK2; IP: GENERIC; PACK_TYPE: SM; ROOM: NONE; OriginalSymbolOrigin: (-75,50); XY: (-1050,2250); VER: 1; ROT: 2; PHYS_PAGE: 164; LOCATION: CR5C1; DRAWING: @RVP1_ADL_SB_ADP_S_DDR5_SODIMM_2DPC_LIB.H55_DG2_2DPC(SCH_1):PAGE533; CDS_LIB: local; VARIANT: ?; PCB Footprint: CTK2_SCR_1300X900_MA; SEC_TYPE: SM; CHIPS_PART_NAME: C_DIODE_SCHOTTKY; CDS_PART_NAME: C_DIODE_SCHOTTKY_SM-G85592-001,DIO,BAT54XV2T1G,10MA,TK2,GENERIC; CDS_LOCATION: CR5C1; ASI_MODEL: G85592-001
EU16501 = C_RT6219: CDS_PHYS_PART_NAME: C_RT6219_LCC-J64861-001,IC,RT6219AGQW,TK2,GENERIC; CDS_LMAN_SYM_OUTLINE: -250,350,250,-350; FP_TECH: TK2; IP: GENERIC; PACK_TYPE: LCC; ROOM: NONE; OriginalSymbolOrigin: (-275,350); XY: (825,2100); VER: 1; ROT: 0; PHYS_PAGE: 164; LOCATION: EU16501; DRAWING: @RVP1_ADL_SB_ADP_S_DDR5_SODIMM_2DPC_LIB.H55_DG2_2DPC(SCH_1):PAGE533; CDS_LIB: local; VARIANT: ?; PCB Footprint: CTK2_LCC10_S3050_DF1625X2475_500_MA; CHIPS_PART_NAME: C_RT6219; CDS_PART_NAME: C_RT6219_LCC-J64861-001,IC,RT6219AGQW,TK2,GENERIC; CDS_LOCATION: EU16501
L16501 = C_INDUCTOR_POL: CDS_PHYS_PART_NAME: C_INDUCTOR_POL_SM-M20012-001,IND,1UH,20%,7.1A,TK0,GENERIC; CDS_LMAN_SYM_OUTLINE: -100,50,100,-50; FP_TECH: TK0; IP: GENERIC; ROOM: NONE; OriginalSymbolOrigin: (-100,50); XY: (2775,2275); VER: 1; ROT: 0; PHYS_PAGE: 164; LOCATION: L16501; DRAWING: @RVP1_ADL_SB_ADP_S_DDR5_SODIMM_2DPC_LIB.H55_DG2_2DPC(SCH_1):PAGE533; CDS_LIB: local; VARIANT: ?; PCB Footprint: CTK0_SMI3225M_3350X2650_MA_VR; SEC_TYPE: SM; CHIPS_PART_NAME: C_INDUCTOR_POL; CDS_PART_NAME: C_INDUCTOR_POL_SM-M20012-001,IND,1UH,20%,7.1A,TK0,GENERIC; CDS_LOCATION: L16501
Q5C1 = C_MOSFET_N#1: CDS_PHYS_PART_NAME: C_MOSFET_N_SOT723-J56149-001,MFET,SSM3K35MFV,TK2,GENERIC; CDS_LMAN_SYM_OUTLINE: -150,150,150,-150; FP_TECH: TK2; IP: GENERIC; PACK_TYPE: SOT723; ROOM: NONE; OriginalSymbolOrigin: (-175,175); XY: (-25,-575); VER: 1; ROT: 0; PHYS_PAGE: 164; LOCATION: Q5C1; DRAWING: @RVP1_ADL_SB_ADP_S_DDR5_SODIMM_2DPC_LIB.H55_DG2_2DPC(SCH_1):PAGE533; CDS_LIB: local; VARIANT: ?; PCB Footprint: CTK2_SOT723_850X1250_400_MA; SEC_TYPE: SOT723; CHIPS_PART_NAME: C_MOSFET_N; CDS_PART_NAME: C_MOSFET_N_SOT723-J56149-001,MFET,SSM3K35MFV,TK2,GENERIC; CDS_LOCATION: Q5C1; ASI_MODEL: J56149-001
Q5C2 = C_MOSFET_N#1: CDS_PHYS_PART_NAME: C_MOSFET_N_SOT723-J56149-001,MFET,SSM3K35MFV,TK2,GENERIC; CDS_LMAN_SYM_OUTLINE: -150,150,150,-150; FP_TECH: TK2; IP: GENERIC; PACK_TYPE: SOT723; ROOM: NONE; OriginalSymbolOrigin: (-175,175); XY: (-925,-450); VER: 1; ROT: 0; PHYS_PAGE: 164; LOCATION: Q5C2; DRAWING: @RVP1_ADL_SB_ADP_S_DDR5_SODIMM_2DPC_LIB.H55_DG2_2DPC(SCH_1):PAGE533; CDS_LIB: local; VARIANT: ?; PCB Footprint: CTK2_SOT723_850X1250_400_MA; SEC_TYPE: SOT723; CHIPS_PART_NAME: C_MOSFET_N; CDS_PART_NAME: C_MOSFET_N_SOT723-J56149-001,MFET,SSM3K35MFV,TK2,GENERIC; CDS_LOCATION: Q5C2; ASI_MODEL: J56149-001
R5C16 = C_RES: PART_NUMBER: A93548-128; CDS_PHYS_PART_NAME: C_RES_0402-A93548-128,RES,100K,1%,0.0625W,TK0,GENERIC; CDS_LMAN_SYM_OUTLINE: -50,50,50,-50; FP_TECH: TK0; IP: GENERIC; ROOM: NONE; WATTAGE: 0.0625W; OriginalSymbolOrigin: (-25,75); XY: (-1400,-600); VER: 2; ROT: 0; PHYS_PAGE: 164; LOCATION: R5C16; DRAWING: @RVP1_ADL_SB_ADP_S_DDR5_SODIMM_2DPC_LIB.H55_DG2_2DPC(SCH_1):PAGE533; CDS_LIB: c_discrete; VARIANT: ?; PCB Footprint: CTK0_SM0402_1100X550_MA; SEC_TYPE: 0402; CHIPS_PART_NAME: C_RES; CDS_PART_NAME: C_RES_0402-A93548-128,RES,100K,1%,0.0625W,TK0,GENERIC; CDS_LOCATION: R5C16; ASI_MODEL: A93548-128
R5C17 = C_RES: PART_NUMBER: A93548-128; CDS_PHYS_PART_NAME: C_RES_0402-A93548-128,RES,100K,1%,0.0625W,TK0,GENERIC; CDS_LMAN_SYM_OUTLINE: -50,50,50,-50; FP_TECH: TK0; IP: GENERIC; ROOM: NONE; WATTAGE: 0.0625W; OriginalSymbolOrigin: (-25,75); XY: (-925,-100); VER: 2; ROT: 0; PHYS_PAGE: 164; LOCATION: R5C17; DRAWING: @RVP1_ADL_SB_ADP_S_DDR5_SODIMM_2DPC_LIB.H55_DG2_2DPC(SCH_1):PAGE533; CDS_LIB: c_discrete; VARIANT: ?; PCB Footprint: CTK0_SM0402_1100X550_MA; SEC_TYPE: 0402; CHIPS_PART_NAME: C_RES; CDS_PART_NAME: C_RES_0402-A93548-128,RES,100K,1%,0.0625W,TK0,GENERIC; CDS_LOCATION: R5C17; ASI_MODEL: A93548-128
R5C18 = C_RES: PART_NUMBER: A93548-128; CDS_PHYS_PART_NAME: C_RES_0402-A93548-128,RES,100K,1%,0.0625W,TK0,GENERIC; CDS_LMAN_SYM_OUTLINE: -50,50,50,-50; FP_TECH: TK0; IP: GENERIC; ROOM: NONE; WATTAGE: 0.0625W; OriginalSymbolOrigin: (-25,75); XY: (-300,-175); VER: 2; ROT: 0; PHYS_PAGE: 164; LOCATION: R5C18; DRAWING: @RVP1_ADL_SB_ADP_S_DDR5_SODIMM_2DPC_LIB.H55_DG2_2DPC(SCH_1):PAGE533; CDS_LIB: c_discrete; VARIANT: ?; PCB Footprint: CTK0_SM0402_1100X550_MA; SEC_TYPE: 0402; CHIPS_PART_NAME: C_RES; CDS_PART_NAME: C_RES_0402-A93548-128,RES,100K,1%,0.0625W,TK0,GENERIC; CDS_LOCATION: R5C18; ASI_MODEL: A93548-128
R5C19 = C_RES#1: CHIPS_PART_NAME: C_RES; CDS_PHYS_PART_NAME: RES_402-0,5%,402"; CDS_PART_NAME: C_RES_0402-A93549-001,RES,0,5%,0.0625W,TK0,GENERIC; CDS_LMAN_SYM_OUTLINE: -50,50,50,-50; FP_TECH: TK0; IP: GENERIC; ROOM: NONE; OriginalSymbolOrigin: (-75,25); XY: (1300,-450); VER: 1; PHYS_PAGE: 164; LOCATION: R5C19; DRAWING: @RVP1_ADL_SB_ADP_S_DDR5_SODIMM_2DPC_LIB.H55_DG2_2DPC(SCH_1):PAGE533; CDS_LIB: c_discrete; VARIANT: ?; PCB Footprint: CTK0_SM0402_1100X550_MA; SEC_TYPE: 0402; ROT: 0; CDS_LOCATION: R5C19; ASI_MODEL: A93549-001
R5C23 = C_RES: PART_NUMBER: A93548-128; CDS_PHYS_PART_NAME: C_RES_0402-A93548-128,EMPTY,100K,1%,0.0625W,TK0,GENERIC; CDS_LMAN_SYM_OUTLINE: -50,50,50,-50; FP_TECH: TK0; IP: GENERIC; ROOM: NONE; OriginalSymbolOrigin: (-25,75); XY: (750,3300); VER: 2; ROT: 0; PHYS_PAGE: 164; LOCATION: R5C23; DRAWING: @RVP1_ADL_SB_ADP_S_DDR5_SODIMM_2DPC_LIB.H55_DG2_2DPC(SCH_1):PAGE533; CDS_LIB: c_discrete; VARIANT: ?; PCB Footprint: CTK0_SM0402_1100X550_MA; SEC_TYPE: 0402; CHIPS_PART_NAME: C_RES; CDS_PART_NAME: C_RES_0402-A93548-128,EMPTY,100K,1%,0.0625W,TK0,GENERIC; CDS_LOCATION: R5C23; ASI_MODEL: A93548-128
R5C24 = C_RES: PART_NUMBER: A93548-128; CDS_PHYS_PART_NAME: C_RES_0402-A93548-128,RES,100K,1%,0.0625W,TK0,GENERIC; CDS_LMAN_SYM_OUTLINE: -50,50,50,-50; FP_TECH: TK0; IP: GENERIC; ROOM: NONE; OriginalSymbolOrigin: (-25,75); XY: (425,3325); VER: 2; ROT: 0; PHYS_PAGE: 164; LOCATION: R5C24; DRAWING: @RVP1_ADL_SB_ADP_S_DDR5_SODIMM_2DPC_LIB.H55_DG2_2DPC(SCH_1):PAGE533; CDS_LIB: c_discrete; VARIANT: ?; PCB Footprint: CTK0_SM0402_1100X550_MA; SEC_TYPE: 0402; CHIPS_PART_NAME: C_RES; CDS_PART_NAME: C_RES_0402-A93548-128,RES,100K,1%,0.0625W,TK0,GENERIC; CDS_LOCATION: R5C24; ASI_MODEL: A93548-128
R5C25 = C_RES#1: CHIPS_PART_NAME: C_RES; CDS_PHYS_PART_NAME: C_RES_0402-A93549-023,RES,10K,5%,0.0625W,TK0,GENERIC; CDS_LMAN_SYM_OUTLINE: -50,50,50,-50; FP_TECH: TK0; IP: GENERIC; ROOM: NONE; OriginalSymbolOrigin: (-75,25); XY: (-400,2550); VER: 1; ROT: 0; PHYS_PAGE: 164; LOCATION: R5C25; DRAWING: @RVP1_ADL_SB_ADP_S_DDR5_SODIMM_2DPC_LIB.H55_DG2_2DPC(SCH_1):PAGE533; CDS_LIB: c_discrete; VARIANT: ?; PCB Footprint: CTK0_SM0402_1100X550_MA; SEC_TYPE: 0402; CDS_PART_NAME: C_RES_0402-A93549-023,RES,10K,5%,0.0625W,TK0,GENERIC; CDS_LOCATION: R5C25; ASI_MODEL: A93549-023
R5C27 = C_RES: CDS_PHYS_PART_NAME: RES_402-102K,1%,402"; CDS_PART_NAME: C_RES_0402-A93548-212,RES,22.6K,1%,0.0625W,TK0,GENERIC; CDS_LMAN_SYM_OUTLINE: -50,50,50,-50; FP_TECH: TK0; IP: GENERIC; ROOM: NONE; OriginalSymbolOrigin: (-25,75); XY: (3875,725); VER: 2; PHYS_PAGE: 164; LOCATION: R5C27; DRAWING: @RVP1_ADL_SB_ADP_S_DDR5_SODIMM_2DPC_LIB.H55_DG2_2DPC(SCH_1):PAGE533; CDS_LIB: c_discrete; VARIANT: ?; PCB Footprint: CTK0_SM0402_1100X550_MA; SEC_TYPE: 0402; ROT: 2; CHIPS_PART_NAME: C_RES; CDS_LOCATION: R5C27; ASI_MODEL: A93548-212
R5C29 = C_RES: CDS_PHYS_PART_NAME: RES_402-51.1K,1%,402"; CDS_PART_NAME: C_RES_0402-A93548-133,RES,30.1K,1%,0.0625W,TK0,GENERIC; CDS_LMAN_SYM_OUTLINE: -50,50,50,-50; FP_TECH: TK0; IP: GENERIC; ROOM: NONE; OriginalSymbolOrigin: (-25,75); XY: (3725,225); VER: 2; ROT: 0; PHYS_PAGE: 164; LOCATION: R5C29; DRAWING: @RVP1_ADL_SB_ADP_S_DDR5_SODIMM_2DPC_LIB.H55_DG2_2DPC(SCH_1):PAGE533; CDS_LIB: c_discrete; VARIANT: ?; PCB Footprint: CTK0_SM0402_1100X550_MA; SEC_TYPE: 0402; CHIPS_PART_NAME: C_RES; CDS_LOCATION: R5C29; ASI_MODEL: A93548-133
R5C32 = C_RES#1: CHIPS_PART_NAME: C_RES; CDS_PHYS_PART_NAME: C_RES_0402-A93548-031,RES,10,1%,0.0625W,TK0,GENERIC; CDS_LMAN_SYM_OUTLINE: -50,50,50,-50; FP_TECH: TK0; IP: GENERIC; ROOM: NONE; OriginalSymbolOrigin: (-75,25); XY: (3350,900); VER: 1; ROT: 0; PHYS_PAGE: 164; LOCATION: R5C32; DRAWING: @RVP1_ADL_SB_ADP_S_DDR5_SODIMM_2DPC_LIB.H55_DG2_2DPC(SCH_1):PAGE533; CDS_LIB: c_discrete; VARIANT: ?; PCB Footprint: CTK0_SM0402_1100X550_MA; SEC_TYPE: 0402; CDS_PART_NAME: C_RES_0402-A93548-031,RES,10,1%,0.0625W,TK0,GENERIC; CDS_LOCATION: R5C32; ASI_MODEL: A93548-031
R5C35 = C_RES#1: PART_NUMBER: A93548-568; CHIPS_PART_NAME: C_RES; CDS_PHYS_PART_NAME: C_RES_0402-A93548-568,RES,2.2,1%,0.0625W,TK0,GENERIC; CDS_LMAN_SYM_OUTLINE: -50,50,50,-50; FP_TECH: TK0; IP: GENERIC; ROOM: NONE; WATTAGE: 0.0625W; OriginalSymbolOrigin: (-75,25); XY: (1550,2350); VER: 1; ROT: 0; PHYS_PAGE: 164; LOCATION: R5C35; DRAWING: @RVP1_ADL_SB_ADP_S_DDR5_SODIMM_2DPC_LIB.H55_DG2_2DPC(SCH_1):PAGE533; CDS_LIB: c_discrete; VARIANT: ?; PCB Footprint: CTK0_SM0402_1100X550_MA; SEC_TYPE: 0402; CDS_PART_NAME: C_RES_0402-A93548-568,RES,2.2,1%,0.0625W,TK0,GENERIC; CDS_LOCATION: R5C35; ASI_MODEL: A93548-568
R16401 = C_RES: PART_NUMBER: A93548-128; CDS_PHYS_PART_NAME: C_RES_0402-A93548-128,EMPTY,100K,1%,0.0625W,TK0,GENERIC; CDS_LMAN_SYM_OUTLINE: -50,50,50,-50; FP_TECH: TK0; IP: GENERIC; ROOM: NONE; OriginalSymbolOrigin: (-25,75); XY: (1125,3300); VER: 2; ROT: 0; PHYS_PAGE: 164; LOCATION: R16401; DRAWING: @RVP1_ADL_SB_ADP_S_DDR5_SODIMM_2DPC_LIB.H55_DG2_2DPC(SCH_1):PAGE533; CDS_LIB: c_discrete; VARIANT: ?; PCB Footprint: CTK0_SM0402_1100X550_MA; CHIPS_PART_NAME: C_RES; CDS_PART_NAME: C_RES_0402-A93548-128,EMPTY,100K,1%,0.0625W,TK0,GENERIC; CDS_LOCATION: R16401; ASI_MODEL: A93548-128
R16402 = C_RES: PART_NUMBER: A93548-128; CDS_PHYS_PART_NAME: C_RES_0402-A93548-128,EMPTY,100K,1%,0.0625W,TK0,GENERIC; CDS_LMAN_SYM_OUTLINE: -50,50,50,-50; FP_TECH: TK0; IP: GENERIC; ROOM: NONE; OriginalSymbolOrigin: (-25,75); XY: (975,3000); VER: 2; ROT: 0; PHYS_PAGE: 164; LOCATION: R16402; DRAWING: @RVP1_ADL_SB_ADP_S_DDR5_SODIMM_2DPC_LIB.H55_DG2_2DPC(SCH_1):PAGE533; CDS_LIB: c_discrete; VARIANT: ?; PCB Footprint: CTK0_SM0402_1100X550_MA; CHIPS_PART_NAME: C_RES; CDS_PART_NAME: C_RES_0402-A93548-128,EMPTY,100K,1%,0.0625W,TK0,GENERIC; CDS_LOCATION: R16402; ASI_MODEL: A93548-128
R16403 = C_RES#1: CHIPS_PART_NAME: C_RES; CDS_PHYS_PART_NAME: C_RES_0402-A93548-220,EMPTY,150K,1%,0.0625W,TK2,GENERIC; CDS_LMAN_SYM_OUTLINE: -50,50,50,-50; FP_TECH: TK2; IP: GENERIC; ROOM: NONE; OriginalSymbolOrigin: (-75,25); XY: (1875,3450); VER: 1; ROT: 0; PHYS_PAGE: 164; LOCATION: R16403; DRAWING: @RVP1_ADL_SB_ADP_S_DDR5_SODIMM_2DPC_LIB.H55_DG2_2DPC(SCH_1):PAGE533; CDS_LIB: c_discrete; VARIANT: ?; PCB Footprint: CTK2_SM0402_1100X550_MA; CDS_PART_NAME: C_RES_0402-A93548-220,EMPTY,150K,1%,0.0625W,TK2,GENERIC; CDS_LOCATION: R16403
R16501 = C_RES: CDS_PHYS_PART_NAME: C_RES_0603-A93550-549,RES,5.1,1%,0.1W,TK2,GENERIC; CDS_LMAN_SYM_OUTLINE: -50,50,50,-50; FP_TECH: TK2; IP: GENERIC; ROOM: NONE; OriginalSymbolOrigin: (-25,75); XY: (-1275,1600); VER: 2; ROT: 5; PHYS_PAGE: 164; LOCATION: R16501; DRAWING: @RVP1_ADL_SB_ADP_S_DDR5_SODIMM_2DPC_LIB.H55_DG2_2DPC(SCH_1):PAGE533; CDS_LIB: c_discrete; VARIANT: ?; PCB Footprint: CTK2_SM0603_1800X900_MA; SEC_TYPE: 0603; CHIPS_PART_NAME: C_RES; CDS_PART_NAME: C_RES_0603-A93550-549,RES,5.1,1%,0.1W,TK2,GENERIC; CDS_LOCATION: R16501
R16502 = C_RES#1: CHIPS_PART_NAME: C_RES; CDS_PHYS_PART_NAME: C_RES_0402-A93549-001,RES,0,5%,0.0625W,TK0,GENERIC; CDS_LMAN_SYM_OUTLINE: -50,50,50,-50; FP_TECH: TK0; IP: GENERIC; ROOM: NONE; OriginalSymbolOrigin: (-75,25); XY: (-650,400); VER: 1; PHYS_PAGE: 164; LOCATION: R16502; DRAWING: @RVP1_ADL_SB_ADP_S_DDR5_SODIMM_2DPC_LIB.H55_DG2_2DPC(SCH_1):PAGE533; CDS_LIB: c_discrete; VARIANT: ?; PCB Footprint: CTK0_SM0402_1100X550_MA; SEC_TYPE: 0402; ROT: 0; CDS_PART_NAME: C_RES_0402-A93549-001,RES,0,5%,0.0625W,TK0,GENERIC; CDS_LOCATION: R16502; ASI_MODEL: A93549-001
R16503 = C_RES#1: PART_NUMBER: A93549-001; CHIPS_PART_NAME: C_RES; CDS_PHYS_PART_NAME: C_RES_0402-A93549-001,RES,0,5%,0.0625W,TK0,GENERIC; CDS_LMAN_SYM_OUTLINE: -50,50,50,-50; FP_TECH: TK0; IP: GENERIC; ROOM: NONE; WATTAGE: 0.0625W; OriginalSymbolOrigin: (-75,25); XY: (-450,2250); VER: 1; PHYS_PAGE: 164; LOCATION: R16503; DRAWING: @RVP1_ADL_SB_ADP_S_DDR5_SODIMM_2DPC_LIB.H55_DG2_2DPC(SCH_1):PAGE533; CDS_LIB: c_discrete; VARIANT: ?; PCB Footprint: CTK0_SM0402_1100X550_MA; SEC_TYPE: 0402; ROT: 0; CDS_PART_NAME: C_RES_0402-A93549-001,RES,0,5%,0.0625W,TK0,GENERIC; CDS_LOCATION: R16503; ASI_MODEL: A93549-001
R16505 = C_RES#1: CHIPS_PART_NAME: C_RES; CDS_PHYS_PART_NAME: C_RES_0805-H19668-001,RES,0.005,1%,0.5W,TK2,GENERIC; CDS_LMAN_SYM_OUTLINE: -50,50,50,-50; FP_TECH: TK2; IP: GENERIC; ROOM: NONE; OriginalSymbolOrigin: (-75,25); XY: (4650,2275); VER: 1; ROT: 0; PHYS_PAGE: 164; LOCATION: R16505; DRAWING: @RVP1_ADL_SB_ADP_S_DDR5_SODIMM_2DPC_LIB.H55_DG2_2DPC(SCH_1):PAGE533; CDS_LIB: c_discrete; VARIANT: ?; PCB Footprint: CTK2_SM0805_2150X1350_MA; CDS_PART_NAME: C_RES_0805-H19668-001,RES,0.005,1%,0.5W,TK2,GENERIC; CDS_LOCATION: R16505
R16507 = C_RES#1: CHIPS_PART_NAME: C_RES; CDS_PHYS_PART_NAME: C_RES_0402-A93549-001,EMPTY,0,5%,0.0625W,TK0,GENERIC; CDS_LMAN_SYM_OUTLINE: -50,50,50,-50; FP_TECH: TK0; IP: GENERIC; ROOM: NONE; OriginalSymbolOrigin: (-75,25); XY: (4875,900); VER: 1; PHYS_PAGE: 164; LOCATION: R16507; DRAWING: @RVP1_ADL_SB_ADP_S_DDR5_SODIMM_2DPC_LIB.H55_DG2_2DPC(SCH_1):PAGE533; CDS_LIB: c_discrete; VARIANT: ?; PCB Footprint: CTK0_SM0402_1100X550_MA; SEC_TYPE: 0402; ROT: 0; CDS_PART_NAME: C_RES_0402-A93549-001,EMPTY,0,5%,0.0625W,TK0,GENERIC; CDS_LOCATION: R16507; ASI_MODEL: A93549-001
R16508 = C_RES#1: CHIPS_PART_NAME: C_RES; CDS_PHYS_PART_NAME: C_RES_0402-A93549-001,RES,0,5%,0.0625W,TK0,GENERIC; CDS_LMAN_SYM_OUTLINE: -50,50,50,-50; FP_TECH: TK0; IP: GENERIC; ROOM: NONE; OriginalSymbolOrigin: (-75,25); XY: (4875,600); VER: 1; PHYS_PAGE: 164; LOCATION: R16508; DRAWING: @RVP1_ADL_SB_ADP_S_DDR5_SODIMM_2DPC_LIB.H55_DG2_2DPC(SCH_1):PAGE533; CDS_LIB: c_discrete; VARIANT: ?; PCB Footprint: CTK0_SM0402_1100X550_MA; SEC_TYPE: 0402; ROT: 0; CDS_PART_NAME: C_RES_0402-A93549-001,RES,0,5%,0.0625W,TK0,GENERIC; CDS_LOCATION: R16508; ASI_MODEL: A93549-001
U5C2 = TTL1G32GF_2: CDS_PHYS_PART_NAME: TTL1G32GF_2_LCC-G59945-001,IC,74AUP1G32GF,TK2,GENERIC; CDS_LMAN_SYM_OUTLINE: -150,150,150,-150; FP_TECH: TK2; IP: GENERIC; PACK_TYPE: LCC; ROOM: NONE; OriginalSymbolOrigin: (-175,150); XY: (700,-200); VER: 1; ROT: 0; PHYS_PAGE: 164; LOCATION: U5C2; DRAWING: @RVP1_ADL_SB_ADP_S_DDR5_SODIMM_2DPC_LIB.H55_DG2_2DPC(SCH_1):PAGE533; CDS_LIB: local; VARIANT: ?; PCB Footprint: TK2_LCC6_S1050_350_MA; SEC_TYPE: LCC; CHIPS_PART_NAME: TTL1G32GF_2; CDS_PART_NAME: TTL1G32GF_2_LCC-G59945-001,IC,74AUP1G32GF,TK2,GENERIC; CDS_LOCATION: U5C2; ASI_MODEL: G59945-001
U16501 = SN74AUP1G97_2: CDS_PHYS_PART_NAME: SN74AUP1G97_2_SON-G84640-001,IC,SN74AUP1G97DSFR,TK2,GENERIC; CDS_LMAN_SYM_OUTLINE: -200,200,200,-150; FP_TECH: TK2; IP: GENERIC; PACK_TYPE: SON; ROOM: NONE; OriginalSymbolOrigin: (-225,200); XY: (2125,-225); VER: 1; ROT: 0; PHYS_PAGE: 164; LOCATION: U16501; DRAWING: @RVP1_ADL_SB_ADP_S_DDR5_SODIMM_2DPC_LIB.H55_DG2_2DPC(SCH_1):PAGE533; CDS_LIB: local; VARIANT: ?; PCB Footprint: TK2_LCC6_S1050_350_MB; SEC_TYPE: SON; CHIPS_PART_NAME: SN74AUP1G97_2; CDS_PART_NAME: SN74AUP1G97_2_SON-G84640-001,IC,SN74AUP1G97DSFR,TK2,GENERIC; CDS_LOCATION: U16501